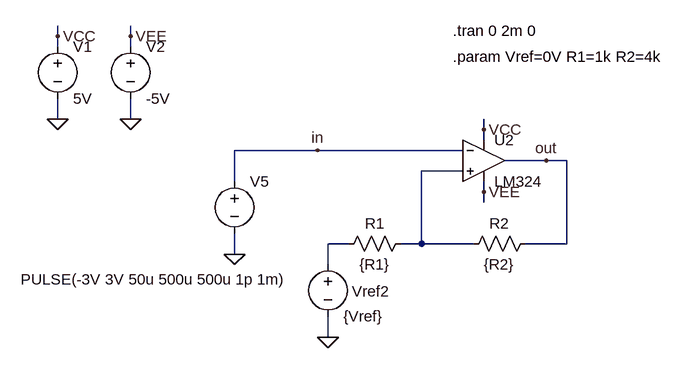
[diagram p0: schematic trigger-Schmitt-inv.asc]
trigger-Schmitt-inv.asc, the LTspice schematic file:
Version 4
SHEET 1 880 680
WIRE -768 64 -768 48
WIRE -656 64 -656 48
WIRE -768 80 -768 64
WIRE -656 80 -656 64
WIRE -768 192 -768 160
WIRE -656 192 -656 160
WIRE -112 208 -112 192
WIRE -112 224 -112 208
WIRE -368 240 -496 240
WIRE -144 240 -368 240
WIRE -16 256 -80 256
WIRE 16 256 -16 256
WIRE -144 272 -208 272
WIRE -496 288 -496 240
WIRE -112 304 -112 288
WIRE -112 320 -112 304
WIRE -320 384 -352 384
WIRE -208 384 -208 272
WIRE -208 384 -240 384
WIRE -128 384 -208 384
WIRE 16 384 16 256
WIRE 16 384 -48 384
WIRE -496 400 -496 368
WIRE -352 416 -352 384
WIRE -352 528 -352 496
FLAG -768 192 0
FLAG -656 192 0
FLAG -768 64 VCC
FLAG -656 64 VEE
FLAG -112 208 VCC
FLAG -112 304 VEE
FLAG -496 400 0
FLAG -352 528 0
FLAG -368 240 in
FLAG -16 256 out
SYMBOL voltage -768 64 R0
WINDOW 123 0 0 Left 2
WINDOW 39 0 0 Left 2
SYMATTR InstName V1
SYMATTR Value 5V
SYMBOL voltage -656 64 R0
WINDOW 123 0 0 Left 2
WINDOW 39 0 0 Left 2
SYMATTR InstName V2
SYMATTR Value -5V
SYMBOL res -224 368 R90
WINDOW 0 0 56 VBottom 2
WINDOW 3 32 56 VTop 2
SYMATTR InstName R1
SYMATTR Value {R1}
SYMBOL res -32 368 R90
WINDOW 0 0 56 VBottom 2
WINDOW 3 32 56 VTop 2
SYMATTR InstName R2
SYMATTR Value {R2}
SYMBOL voltage -496 272 R0
WINDOW 123 0 0 Left 2
WINDOW 39 0 0 Left 2
WINDOW 3 -329 167 Left 2
SYMATTR Value PULSE(-3V 3V 50u 500u 500u 1p 1m)
SYMATTR InstName V5
SYMBOL voltage -352 400 R0
WINDOW 0 37 57 Left 2
SYMATTR InstName Vref2
SYMATTR Value {Vref}
SYMBOL LM324 -112 192 R0
SYMATTR InstName U2
TEXT -160 56 Left 2 !.tran 0 2m 0
TEXT -160 96 Left 2 !.param Vref=0V R1=1k R2=4k

The netlist it stands for:
* trigger-Schmitt-inv.asc
V1 VCC 0 5V
V2 VEE 0 -5V
R1 N001 N002 {R1}
R2 out N001 {R2}
V5 in 0 PULSE(-3V 3V 50u 500u 500u 1p 1m)
Vref2 N002 0 {Vref}
* U2: LM324 (symbol LM324 not available, pins judged from their places): In+=N001 In-=in V+=VCC V-=VEE OUT=out
.tran 0 2m 0
.param Vref=0V R1=1k R2=4k
.backanno
.end